# EAGLE schematic AQ_Baloo_t (EAGLE 5.11)
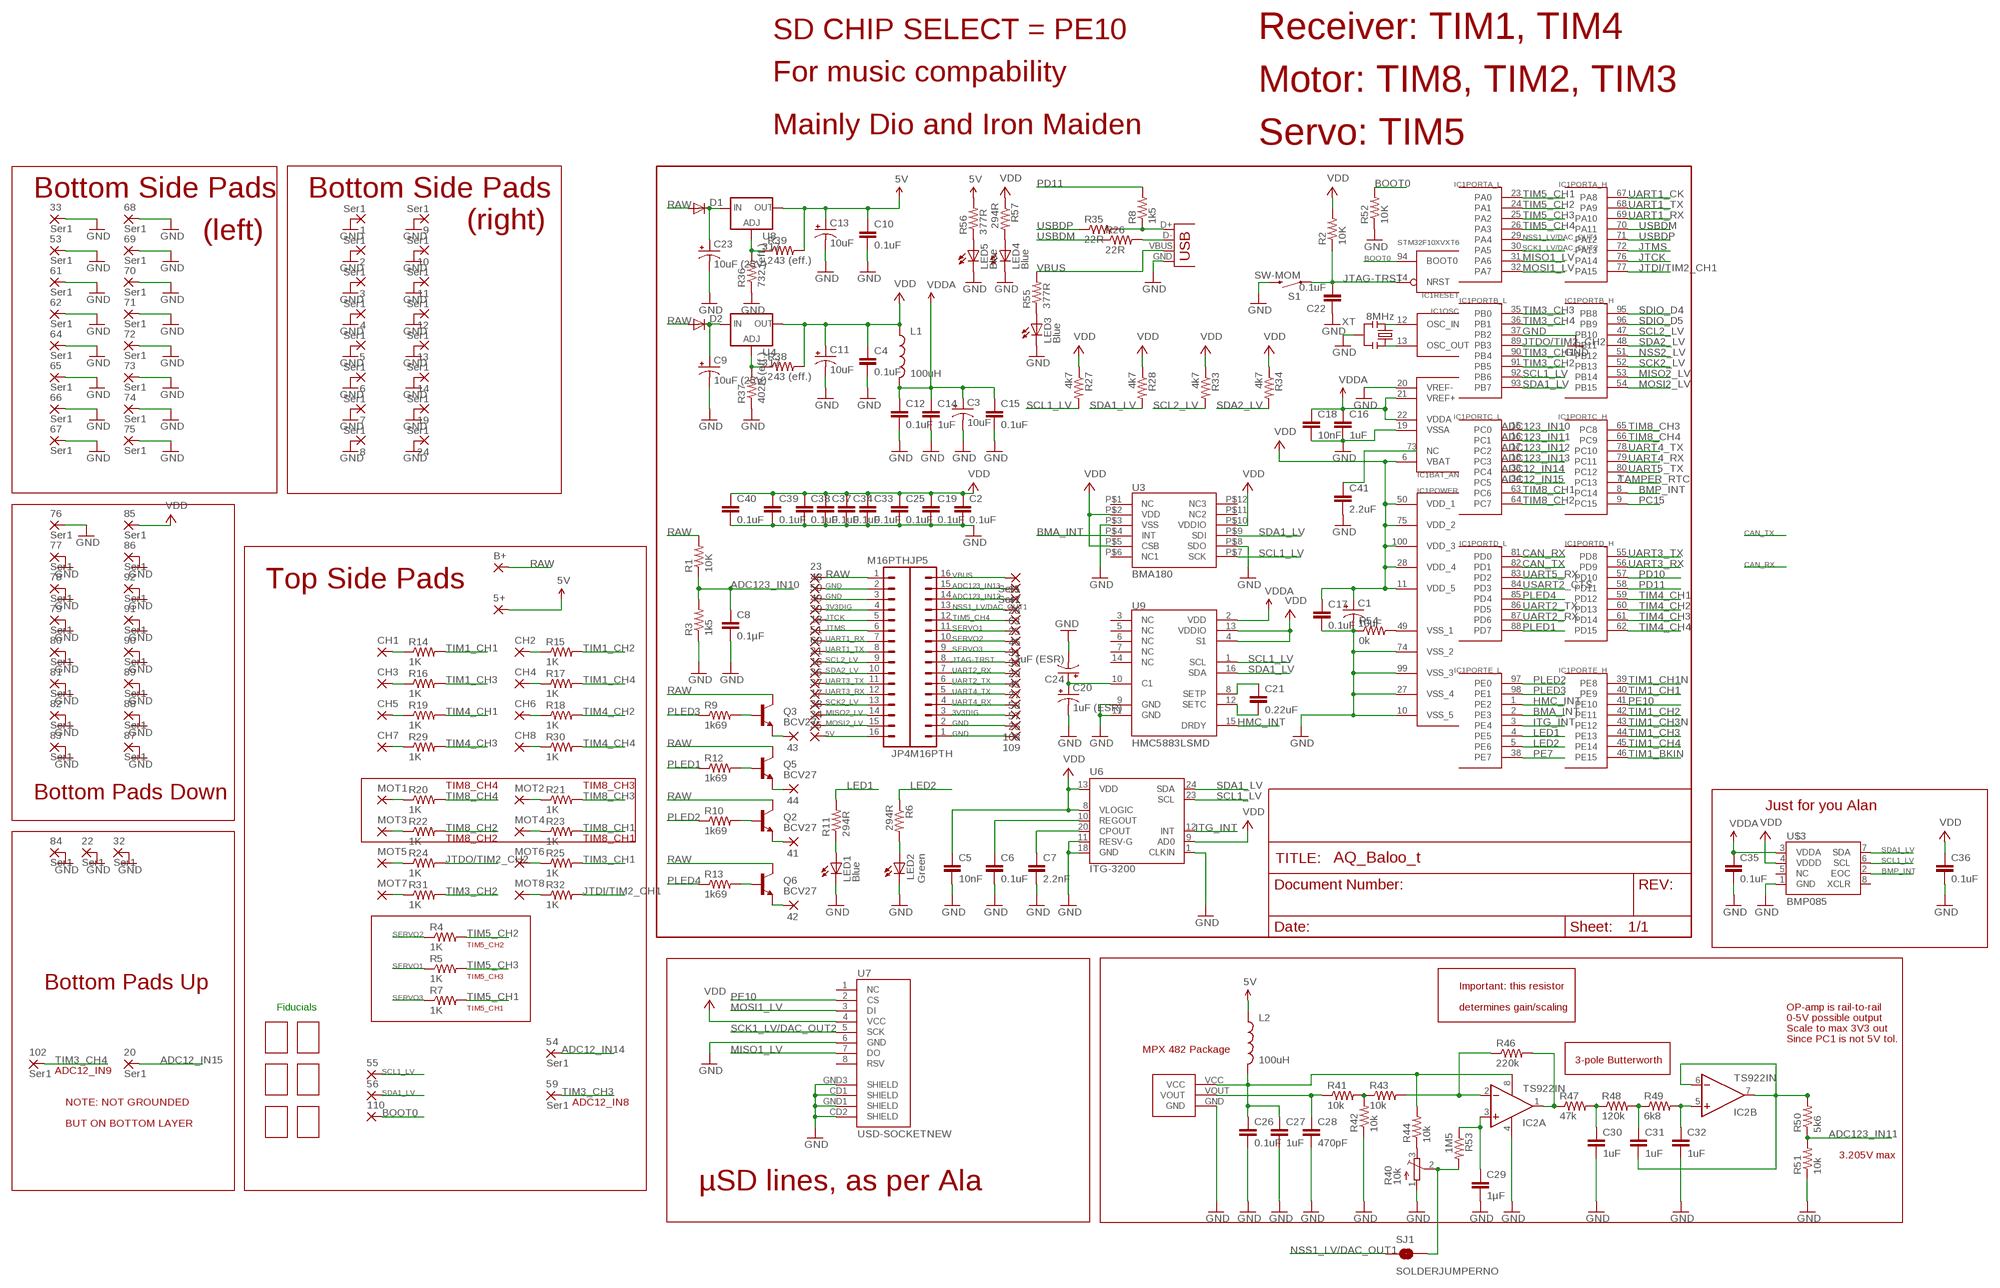
[diagram p0: schematic, sheet 1]

## Parts
1  Ser1  WIREPADSMD1,27-254  [SMD1,27-2,54]
2  Ser1  WIREPADSMD1,27-254  [SMD1,27-2,54]
3  Ser1  WIREPADSMD1,27-254  [SMD1,27-2,54]
4  Ser1  WIREPADSMD1,27-254  [SMD1,27-2,54]
5  Ser1  WIREPADSMD1,27-254  [SMD1,27-2,54]
5+  WIREPADSMD1,27-254  [SMD1,27-2,54]
6  Ser1  WIREPADSMD1,27-254  [SMD1,27-2,54]
7  Ser1  WIREPADSMD1,27-254  [SMD1,27-2,54]
8  Ser1  WIREPADSMD1,27-254  [SMD1,27-2,54]
9  Ser1  WIREPADSMD1,27-254  [SMD1,27-2,54]
10  Ser1  WIREPADSMD1,27-254  [SMD1,27-2,54]
11  Ser1  WIREPADSMD1,27-254  [SMD1,27-2,54]
12  Ser1  WIREPADSMD1,27-254  [SMD1,27-2,54]
13  Ser1  WIREPADSMD1,27-254  [SMD1,27-2,54]
14  Ser1  WIREPADSMD1,27-254  [SMD1,27-2,54]
15  WIREPADSMD1,27-254  [SMD1,27-2,54]
16  WIREPADSMD1,27-254  [SMD1,27-2,54]
17  WIREPADSMD1,27-254  [SMD1,27-2,54]
18  WIREPADSMD1,27-254  [SMD1,27-2,54]
19  Ser1  WIREPADSMD1,27-254  [SMD1,27-2,54]
20  Ser1  WIREPADSMD1,27-254  [SMD1,27-2,54]
21  WIREPADSMD1,27-254  [SMD1,27-2,54]
22  Ser1  WIREPADSMD1,27-254  [SMD1,27-2,54]
23  WIREPADSMD1,27-254  [SMD1,27-2,54]
24  Ser1  WIREPADSMD1,27-254  [SMD1,27-2,54]
25  WIREPADSMD1,27-254  [SMD1,27-2,54]
26  WIREPADSMD1,27-254  [SMD1,27-2,54]
27  WIREPADSMD1,27-254  [SMD1,27-2,54]
28  Ser1  WIREPADSMD1,27-254  [SMD1,27-2,54]
29  WIREPADSMD1,27-254  [SMD1,27-2,54]
30  WIREPADSMD1,27-254  [SMD1,27-2,54]
31  WIREPADSMD1,27-254  [SMD1,27-2,54]
32  Ser1  WIREPADSMD1,27-254  [SMD1,27-2,54]
33  Ser1  WIREPADSMD1,27-254  [SMD1,27-2,54]
34  WIREPADSMD1,27-254  [SMD1,27-2,54]
35  WIREPADSMD1,27-254  [SMD1,27-2,54]
36  WIREPADSMD1,27-254  [SMD1,27-2,54]
37  WIREPADSMD1,27-254  [SMD1,27-2,54]
38  WIREPADSMD1,27-254  [SMD1,27-2,54]
39  WIREPADSMD1,27-254  [SMD1,27-2,54]
41  WIREPADSMD1,27-254  [SMD1,27-2,54]
42  WIREPADSMD1,27-254  [SMD1,27-2,54]
43  WIREPADSMD1,27-254  [SMD1,27-2,54]
44  WIREPADSMD1,27-254  [SMD1,27-2,54]
45  WIREPADSMD1,27-254  [SMD1,27-2,54]
46  WIREPADSMD1,27-254  [SMD1,27-2,54]
47  WIREPADSMD1,27-254  [SMD1,27-2,54]
48  WIREPADSMD1,27-254  [SMD1,27-2,54]
49  WIREPADSMD1,27-254  [SMD1,27-2,54]
50  WIREPADSMD1,27-254  [SMD1,27-2,54]
51  WIREPADSMD1,27-254  [SMD1,27-2,54]
53  Ser1  WIREPADSMD1,27-254  [SMD1,27-2,54]
54  Ser1  WIREPADSMD1,27-254  [SMD1,27-2,54]
55  WIREPADSMD1,27-254  [SMD1,27-2,54]
56  WIREPADSMD1,27-254  [SMD1,27-2,54]
57  WIREPADSMD1,27-254  [SMD1,27-2,54]
58  WIREPADSMD1,27-254  [SMD1,27-2,54]
59  Ser1  WIREPADSMD1,27-254  [SMD1,27-2,54]
60  WIREPADSMD1,27-254  [SMD1,27-2,54]
61  Ser1  WIREPADSMD1,27-254  [SMD1,27-2,54]
62  Ser1  WIREPADSMD1,27-254  [SMD1,27-2,54]
63  Ser1  WIREPADSMD1,27-254  [SMD1,27-2,54]
64  Ser1  WIREPADSMD1,27-254  [SMD1,27-2,54]
65  Ser1  WIREPADSMD1,27-254  [SMD1,27-2,54]
66  Ser1  WIREPADSMD1,27-254  [SMD1,27-2,54]
67  Ser1  WIREPADSMD1,27-254  [SMD1,27-2,54]
68  Ser1  WIREPADSMD1,27-254  [SMD1,27-2,54]
69  Ser1  WIREPADSMD1,27-254  [SMD1,27-2,54]
70  Ser1  WIREPADSMD1,27-254  [SMD1,27-2,54]
71  Ser1  WIREPADSMD1,27-254  [SMD1,27-2,54]
72  Ser1  WIREPADSMD1,27-254  [SMD1,27-2,54]
73  Ser1  WIREPADSMD1,27-254  [SMD1,27-2,54]
74  Ser1  WIREPADSMD1,27-254  [SMD1,27-2,54]
75  Ser1  WIREPADSMD1,27-254  [SMD1,27-2,54]
76  Ser1  WIREPADSMD1,27-254  [SMD1,27-2,54]
77  Ser1  WIREPADSMD1,27-254  [SMD1,27-2,54]
78  Ser1  WIREPADSMD1,27-254  [SMD1,27-2,54]
79  Ser1  WIREPADSMD1,27-254  [SMD1,27-2,54]
80  Ser1  WIREPADSMD1,27-254  [SMD1,27-2,54]
81  Ser1  WIREPADSMD1,27-254  [SMD1,27-2,54]
82  Ser1  WIREPADSMD1,27-254  [SMD1,27-2,54]
83  Ser1  WIREPADSMD1,27-254  [SMD1,27-2,54]
84  Ser1  WIREPADSMD1,27-254  [SMD1,27-2,54]
85  Ser1  WIREPADSMD1,27-254  [SMD1,27-2,54]
86  Ser1  WIREPADSMD1,27-254  [SMD1,27-2,54]
87  Ser1  WIREPADSMD1,27-254  [SMD1,27-2,54]
88  Ser1  WIREPADSMD1,27-254  [SMD1,27-2,54]
89  Ser1  WIREPADSMD1,27-254  [SMD1,27-2,54]
90  Ser1  WIREPADSMD1,27-254  [SMD1,27-2,54]
91  Ser1  WIREPADSMD1,27-254  [SMD1,27-2,54]
92  Ser1  WIREPADSMD1,27-254  [SMD1,27-2,54]
102  Ser1  WIREPADSMD1,27-254  [SMD1,27-2,54]
108  WIREPADSMD1,27-254  [SMD1,27-2,54]
109  WIREPADSMD1,27-254  [SMD1,27-2,54]
110  WIREPADSMD1,27-254  [SMD1,27-2,54]
B+  WIREPADSMD1,27-254  [SMD1,27-2,54]
C1  10uF  CPOL-USSMCZ  [SMC_Z]
C2  0.1uF  CAP0402  [C0402]
C3  10uF  CAP_POL1206  [EIA3216]
C4  0.1uF  CAP0402  [C0402]
C5  10nF  CAP0402  [C0402]
C6  0.1uF  CAP0402  [C0402]
C7  2.2nF  CAP0402  [C0402]
C8  0.1µF  CAP0402  [C0402]
C9  10uF (25V)  CAP_POL1206  [EIA3216]
C10  0.1uF  CAP0402  [C0402]
C11  10uF  CAP_POL1206  [EIA3216]
C12  0.1uF  CAP0402  [C0402]
C13  10uF  CAP_POL1206  [EIA3216]
C14  1uF  CAP0402  [C0402]
C15  0.1uF  CAP0402  [C0402]
C16  1uF  CAP0402  [C0402]
C17  0.1uF  CAP0402  [C0402]
C18  10nF  CAP0402  [C0402]
C19  0.1uF  CAP0402  [C0402]
C20  1uF (ESR)  CPOL-USSMCZ  [SMC_Z]
C21  0.22uF  CAP0402  [C0402]
C22  0.1uF  CAP0402  [C0402]
C23  10uF (25V)  CAP_POL1206  [EIA3216]
C24  1uF (ESR)  CPOL-USSMCZ  [SMC_Z]
C25  0.1uF  CAP0402  [C0402]
C26  0.1uF  CAP0402  [C0402]
C27  1uF  CAP0402  [C0402]
C28  470pF  CAP0402  [C0402]
C29  1µF  CAP0402  [C0402]
C30  1uF  CAP0402  [C0402]
C31  1uF  CAP0402  [C0402]
C32  1uF  CAP0402  [C0402]
C33  0.1uF  CAP0402  [C0402]
C34  0.1uF  CAP0402  [C0402]
C35  0.1uF  CAP0402  [C0402]
C36  0.1uF  CAP0402  [C0402]
C37  0.1uF  CAP0402  [C0402]
C38  0.1uF  CAP0402  [C0402]
C39  0.1uF  CAP0402  [C0402]
C40  0.1uF  CAP0402  [C0402]
C41  2.2uF  CAP0402  [C0402]
CH1  WIREPADSMD1,27-254  [SMD1,27-2,54]
CH2  WIREPADSMD1,27-254  [SMD1,27-2,54]
CH3  WIREPADSMD1,27-254  [SMD1,27-2,54]
CH4  WIREPADSMD1,27-254  [SMD1,27-2,54]
CH5  WIREPADSMD1,27-254  [SMD1,27-2,54]
CH6  WIREPADSMD1,27-254  [SMD1,27-2,54]
CH7  WIREPADSMD1,27-254  [SMD1,27-2,54]
CH8  WIREPADSMD1,27-254  [SMD1,27-2,54]
D1  DIODESOD  [SOD-323]
D2  DIODESOD  [SOD-323]
IC1  STM32F10XVXT6  [TQFP100]
IC2  TS922IN  LM358D  [SO08]
JP4  M16PTH  [1X16]
JP5  M16PTH  [1X16]
L1  100uH  INDUCTOR0805  [0805]
L2  100uH  INDUCTOR0805  [0805]
LED1  Blue  LED0603  [LED-0603]
LED2  Green  LED0603  [LED-0603]
LED3  Blue  LED0603  [LED-0603]
LED4  Blue  LED0603  [LED-0603]
LED5  Blue  LED0603  [LED-0603]
MOT1  WIREPADSMD1,27-254  [SMD1,27-2,54]
MOT2  WIREPADSMD1,27-254  [SMD1,27-2,54]
MOT3  WIREPADSMD1,27-254  [SMD1,27-2,54]
MOT4  WIREPADSMD1,27-254  [SMD1,27-2,54]
MOT5  WIREPADSMD1,27-254  [SMD1,27-2,54]
MOT6  WIREPADSMD1,27-254  [SMD1,27-2,54]
MOT7  WIREPADSMD1,27-254  [SMD1,27-2,54]
MOT8  WIREPADSMD1,27-254  [SMD1,27-2,54]
Q2  BCV27  TRANSISTOR_NPNSOT23-3  [SOT23-3]
Q3  BCV27  TRANSISTOR_NPNSOT23-3  [SOT23-3]
Q5  BCV27  TRANSISTOR_NPNSOT23-3  [SOT23-3]
Q6  BCV27  TRANSISTOR_NPNSOT23-3  [SOT23-3]
R1  10K  RESISTOR0402  [C0402]
R2  10K  RESISTOR0402  [C0402]
R3  1k5  RESISTOR0402  [C0402]
R4  1K  RESISTOR0402  [C0402]
R5  1K  RESISTOR0402  [C0402]
R6  294R  RESISTOR0402  [C0402]
R7  1K  RESISTOR0402  [C0402]
R8  1k5  RESISTOR0402  [C0402]
R9  1k69  RESISTOR0402  [C0402]
R10  1k69  RESISTOR0402  [C0402]
R11  294R  RESISTOR0402  [C0402]
R12  1k69  RESISTOR0402  [C0402]
R13  1k69  RESISTOR0402  [C0402]
R14  1K  RESISTOR0402  [C0402]
R15  1K  RESISTOR0402  [C0402]
R16  1K  RESISTOR0402  [C0402]
R17  1K  RESISTOR0402  [C0402]
R18  1K  RESISTOR0402  [C0402]
R19  1K  RESISTOR0402  [C0402]
R20  1K  RESISTOR0402  [C0402]
R21  1K  RESISTOR0402  [C0402]
R22  1K  RESISTOR0402  [C0402]
R23  1K  RESISTOR0402  [C0402]
R24  1K  RESISTOR0402  [C0402]
R25  1K  RESISTOR0402  [C0402]
R26  22R  RESISTOR0402  [C0402]
R27  4k7  RESISTOR0402  [C0402]
R28  4k7  RESISTOR0402  [C0402]
R29  1K  RESISTOR0402  [C0402]
R30  1K  RESISTOR0402  [C0402]
R31  1K  RESISTOR0402  [C0402]
R32  1K  RESISTOR0402  [C0402]
R33  4k7  RESISTOR0402  [C0402]
R34  4k7  RESISTOR0402  [C0402]
R35  22R  RESISTOR0402  [C0402]
R36  732 (eff.)  RESISTOR0603  [0603]
R37  402R (eff.)  RESISTOR0603  [0603]
R38  243 (eff.)  RESISTOR0603  [0603]
R39  243 (eff.)  RESISTOR0603  [0603]
R40  10k  TRIM_EU-3223J  [3223J]
R41  10k  RESISTOR0402  [C0402]
R42  10k  RESISTOR0402  [C0402]
R43  10k  RESISTOR0402  [C0402]
R44  10k  RESISTOR0402  [C0402]
R46  220k  RESISTOR0402  [C0402]
R47  47k  RESISTOR0402  [C0402]
R48  120k  RESISTOR0402  [C0402]
R49  6k8  RESISTOR0402  [C0402]
R50  5k6  RESISTOR0402  [C0402]
R51  10k  RESISTOR0402  [C0402]
R52  10K  RESISTOR0402  [C0402]
R53  1M5  RESISTOR0402  [C0402]
R54  0k  RESISTOR0402  [C0402]
R55  377R  RESISTOR0402  [C0402]
R56  377R  RESISTOR0402  [C0402]
R57  294R  RESISTOR0402  [C0402]
S1  SW-MOM  SWITCH-MOMENTARY-2SMD  [TACTILE_SWITCH_SMD]
SJ1  SOLDERJUMPERNO  [SJ_2S-NO]
U3  BMA180  [LGA12]
U4  317  V_REG_317SMD  [SOT223]
U6  ITG-3200  [QFN-24]
U7  USD-SOCKETNEW  [MICRO-SD-SOCKET-PP]
U8  317  V_REG_317SMD  [SOT223]
U9  HMC5883LSMD  [16LPCC]
U$2  MPX_SMD  [MPX_SMD]
U$3  BMP085  [BMP085]
U$7  PAD.03  [PAD.03X.03]
U$9  PAD.03  [PAD.03X.03]
U$10  PAD.03  [PAD.03X.03]
U$11  PAD.03  [PAD.03X.03]
U$12  PAD.03  [PAD.03X.03]
U$13  PAD.03  [PAD.03X.03]
X2  USBOLD  [USB-MINIB-OLD]
XT  8MHz  RESONATORSMD  [RESONATOR-SMD]

## Nets
3IN [vcc]: C9.A(+) D2.1(C) U4.3(IN)
3V3AN: C3.A(+) C12.1 C14.1 C15.1 C16.1 C18.1 C35.1 IC1.21(BAT_AN:VREF+) IC1.22(BAT_AN:VDDA) L1.2 U9.2(VDD) U$3.3(VDDA) ; supply symbol labelled VDDA
3V3DIG: 26.1(P) 49.1(P) 85.1(P) C1.+ C2.1 C4.1 C5.1 C11.A(+) C17.1 C19.1 C25.1 C33.1 C34.1 C36.1 C37.1 C38.1 C39.1 C40.1 IC1.6(BAT_AN:VBAT) IC1.11(POWER:VDD_5) IC1.28(POWER:VDD_4) IC1.50(POWER:VDD_1) IC1.75(POWER:VDD_2) IC1.100(POWER:VDD_3) JP4.4 JP5.3 L1.1 R2.2 R27.1 R28.1 R33.1 R34.1 R38.2 R57.1 U3.P$2(VDD) U3.P$5(CSB) U3.P$10(VDDIO) U4.2(OUT) U6.8(VLOGIC) U6.9(AD0) U6.13(VDD) U7.4(VCC) U9.4(S1) U9.13(VDDIO) U$3.4(VDDD) ; supply symbol labelled VDD
5IN [vcc]: C23.A(+) D1.1(C) U8.3(IN)
5V: 5+.1(P) 35.1(P) C10.1 C13.A(+) JP4.16 L2.1 R39.2 R56.2 U8.2(OUT)
ADC12_IN14: 54.1(P) IC1.33(PORTC_L:PC4)
ADC12_IN15: 20.1(P) IC1.34(PORTC_L:PC5)
ADC123_IN10: C8.1 IC1.15(PORTC_L:PC0) R1.1 R3.2
ADC123_IN11: IC1.16(PORTC_L:PC1) R50.1 R51.2
ADC123_IN12: 28.1(P) IC1.17(PORTC_L:PC2) JP5.14
ADC123_IN13: 47.1(P) IC1.18(PORTC_L:PC3) JP5.15
BMA_INT: IC1.2(PORTE_L:PE3) U3.P$4(INT)
BMP_INT: IC1.8(PORTC_H:PC14) U$3.2(EOC)
BOOT0: 110.1(P) IC1.94(RESET:BOOT0) R52.2
CAN_RX: IC1.81(PORTD_L:PD0)
CAN_TX: IC1.82(PORTD_L:PD1)
GND [vcc]: 1.1(P) 2.1(P) 3.1(P) 4.1(P) 5.1(P) 6.1(P) 7.1(P) 8.1(P) 9.1(P) 10.1(P) 11.1(P) 12.1(P) 13.1(P) 14.1(P) 19.1(P) 22.1(P) 24.1(P) 32.1(P) 33.1(P) 48.1(P) 50.1(P) 53.1(P) 61.1(P) 62.1(P) 64.1(P) 65.1(P) 66.1(P) 67.1(P) 68.1(P) 69.1(P) 70.1(P) 71.1(P) 72.1(P) 73.1(P) 74.1(P) 75.1(P) 76.1(P) 77.1(P) 78.1(P) 79.1(P) 80.1(P) 81.1(P) 82.1(P) 83.1(P) 84.1(P) 86.1(P) 87.1(P) 88.1(P) 89.1(P) 90.1(P) 91.1(P) 92.1(P) 108.1(P) 109.1(P) C1.- C2.2 C3.C(-) C4.2 C5.2 C6.2 C7.2 C8.2 C9.C(-) C10.2 C11.C(-) C12.2 C13.C(-) C14.2 C15.2 C16.2 C17.2 C18.2 C19.2 C20.- C22.1 C23.C(-) C24.- C25.2 C26.2 C27.2 C28.2 C29.2 C30.2 C32.2 C33.2 C34.2 C35.2 C36.2 C37.2 C38.2 C39.2 C40.2 C41.2 IC1.10(POWER:VSS_5) IC1.19(BAT_AN:VSSA) IC1.20(BAT_AN:VREF-) IC1.27(POWER:VSS_4) IC1.37(PORTB_L:PB2) IC1.74(POWER:VSS_2) IC1.99(POWER:VSS_3) IC2.4(P:V-) JP4.2 JP4.3 JP5.1 JP5.2 LED1.C LED2.C LED3.C LED4.C LED5.C R3.1 R36.1 R37.1 R40.1(A) R42.1 R51.1 R52.1 R54.1 S1.3 U3.P$3(VSS) U3.P$8(SDO) U6.1(CLKIN) U6.11(RESV-G) U6.18(GND) U7.6(GND) U7.CD1(SHIELD) U7.CD2(SHIELD) U7.GND1(SHIELD) U7.GND3(SHIELD) U9.9(GND) U9.11(GND) U$2.GND U$3.1(GND) X2.GND XT.2
HMC_INT: IC1.1(PORTE_L:PE2) U9.15(DRDY)
ITG_INT: IC1.3(PORTE_L:PE4) U6.12(INT)
JTAG-TRST: 29.1(P) C22.2 IC1.14(RESET:NRST) JP5.8 R2.1 S1.1
JTCK: 39.1(P) IC1.76(PORTA_H:PA14) JP4.5
JTDI/TIM2_CH1: IC1.77(PORTA_H:PA15) R32.2
JTDO/TIM2_CH2: IC1.89(PORTB_L:PB3) R24.2
JTMS: 18.1(P) IC1.72(PORTA_H:PA13) JP4.6
LED1: IC1.4(PORTE_L:PE5) R11.2
LED2: IC1.5(PORTE_L:PE6) R6.1
MISO1_LV: IC1.31(PORTA_L:PA6) U7.7(DO)
MISO2_LV: 38.1(P) IC1.53(PORTB_H:PB14) JP4.14
MOSI1_LV: IC1.32(PORTA_L:PA7) U7.3(DI)
MOSI2_LV: 34.1(P) IC1.54(PORTB_H:PB15) JP4.15
N$1: IC1.12(OSC:OSC_IN) XT.3
N$2: IC1.13(OSC:OSC_OUT) XT.1
N$3: CH4.1(P) R17.1
N$4: MOT1.1(P) R20.1
N$5: R40.2(S) R53.2 SJ1.2
N$6: C6.1 U6.10(REGOUT)
N$7: LED2.A R6.2
N$8: C7.1 U6.20(CPOUT)
N$9: Q3.1(B) R9.2
N$10: IC1.49(POWER:VSS_1) R54.2
N$11: Q2.1(B) R10.2
N$12: Q5.1(B) R12.2
N$13: MOT2.1(P) R21.1
N$14: MOT3.1(P) R22.1
N$15: LED1.A R11.1
N$16: R36.2 R39.1 U8.1(ADJ)
N$17: CH1.1(P) R14.1
N$18: CH2.1(P) R15.1
N$19: CH3.1(P) R16.1
N$20: MOT4.1(P) R23.1
N$21: CH5.1(P) R19.1
N$22: CH6.1(P) R18.1
N$23: Q6.1(B) R13.2
N$24: 41.1(P) Q2.2(E)
N$25: 42.1(P) Q6.2(E)
N$26: 43.1(P) Q3.2(E)
N$27: 44.1(P) Q5.2(E)
N$28: C41.1 IC1.73(BAT_AN:NC)
N$29: LED3.A R55.1
N$30: CH7.1(P) R29.1
N$31: MOT5.1(P) R24.1
N$32: MOT6.1(P) R25.1
N$33: R37.2 R38.1 U4.1(ADJ)
N$34: LED4.A R57.2
N$35: LED5.A R56.1
N$37: CH8.1(P) R30.1
N$38: MOT7.1(P) R31.1
N$39: MOT8.1(P) R32.1
N$41: C21.1 U9.8(SETP)
N$42: C21.2 U9.12(SETC)
N$43: C26.1 C27.1 IC2.8(P:V+) L2.2 R44.2 U$2.VCC
N$67: C20.+ C24.+ U9.10(C1)
N$72: R8.1 R35.2 X2.D+
N$74: R26.2 X2.D-
N$76: C28.1 R41.1 U$2.VOUT
N$77: R41.2 R42.2 R43.1
N$79: IC2.2(A:-IN) R43.2 R46.1
N$80: C29.1 IC2.3(A:+IN) R53.1
N$81: R40.3(E) R44.1
N$82: IC2.1(A:OUT) R46.2 R47.1
N$98: C30.1 R47.2 R48.1
N$99: C31.1 R48.2 R49.1
N$100: C32.1 IC2.5(B:+IN) R49.2
N$101: C31.2 IC2.6(B:-IN) IC2.7(B:OUT) R50.2
NSS1_LV/DAC_OUT1: 63.1(P) IC1.29(PORTA_L:PA4) JP5.13 SJ1.1
NSS2_LV: IC1.51(PORTB_H:PB12)
PC15: IC1.9(PORTC_H:PC15)
PD10: IC1.57(PORTD_H:PD10)
PD11: IC1.58(PORTD_H:PD11) R8.2
PE7: IC1.38(PORTE_L:PE7)
PE10: IC1.41(PORTE_H:PE10) U7.2(CS)
PLED1: IC1.88(PORTD_L:PD7) R12.1
PLED2: IC1.97(PORTE_L:PE0) R10.1
PLED3: IC1.98(PORTE_L:PE1) R9.1
PLED4: IC1.85(PORTD_L:PD4) R13.1
RAW [vcc]: 23.1(P) B+.1(P) D1.2(A) D2.2(A) JP4.1 Q2.3(C) Q3.3(C) Q5.3(C) Q6.3(C) R1.2
SCK1_LV/DAC_OUT2: IC1.30(PORTA_L:PA5) U7.5(SCK)
SCK2_LV: 17.1(P) IC1.52(PORTB_H:PB13) JP4.13
SCL1_LV: 55.1(P) IC1.92(PORTB_L:PB6) R27.2 U3.P$7(SCK) U6.23(SCL) U9.1(SCL) U$3.6(SCL)
SCL2_LV: 21.1(P) IC1.47(PORTB_H:PB10) JP4.9 R33.2
SDA1_LV: 56.1(P) IC1.93(PORTB_L:PB7) R28.2 U3.P$9(SDI) U6.24(SDA) U9.16(SDA) U$3.7(SDA)
SDA2_LV: 16.1(P) IC1.48(PORTB_H:PB11) JP4.10 R34.2
SDIO_D4: IC1.95(PORTB_H:PB8)
SDIO_D5: IC1.96(PORTB_H:PB9)
SERVO1: 46.1(P) JP5.11 R5.1
SERVO2: 31.1(P) JP5.10 R4.1
SERVO3: 30.1(P) JP5.9 R7.1
TAMPER_RTC: IC1.7(PORTC_H:PC13)
TIM1_BKIN: IC1.46(PORTE_H:PE15)
TIM1_CH1: IC1.40(PORTE_H:PE9) R14.2
TIM1_CH1N: IC1.39(PORTE_H:PE8)
TIM1_CH2: IC1.42(PORTE_H:PE11) R15.2
TIM1_CH3: IC1.44(PORTE_H:PE13) R16.2
TIM1_CH3N: IC1.43(PORTE_H:PE12)
TIM1_CH4: IC1.45(PORTE_H:PE14) R17.2
TIM3_CH1: IC1.90(PORTB_L:PB4) R25.2
TIM3_CH2: IC1.91(PORTB_L:PB5) R31.2
TIM3_CH3: 59.1(P) IC1.35(PORTB_L:PB0)
TIM3_CH4: 102.1(P) IC1.36(PORTB_L:PB1)
TIM4_CH1: IC1.59(PORTD_H:PD12) R19.2
TIM4_CH2: IC1.60(PORTD_H:PD13) R18.2
TIM4_CH3: IC1.61(PORTD_H:PD14) R29.2
TIM4_CH4: IC1.62(PORTD_H:PD15) R30.2
TIM5_CH1: IC1.23(PORTA_L:PA0) R7.2
TIM5_CH2: IC1.24(PORTA_L:PA1) R4.2
TIM5_CH3: IC1.25(PORTA_L:PA2) R5.2
TIM5_CH4: 25.1(P) IC1.26(PORTA_L:PA3) JP5.12
TIM8_CH1: IC1.63(PORTC_L:PC6) R23.2
TIM8_CH2: IC1.64(PORTC_L:PC7) R22.2
TIM8_CH3: IC1.65(PORTC_H:PC8) R21.2
TIM8_CH4: IC1.66(PORTC_H:PC9) R20.2
UART1_CK: IC1.67(PORTA_H:PA8)
UART1_RX: 51.1(P) IC1.69(PORTA_H:PA10) JP4.7
UART1_TX: 60.1(P) IC1.68(PORTA_H:PA9) JP4.8
UART2_RX: 45.1(P) IC1.87(PORTD_L:PD6) JP5.7
UART2_TX: 27.1(P) IC1.86(PORTD_L:PD5) JP5.6
UART3_RX: 37.1(P) IC1.56(PORTD_H:PD9) JP4.12
UART3_TX: 36.1(P) IC1.55(PORTD_H:PD8) JP4.11
UART4_RX: 57.1(P) IC1.79(PORTC_H:PC11) JP5.4
UART4_TX: 58.1(P) IC1.78(PORTC_H:PC10) JP5.5
UART5_RX: IC1.83(PORTD_L:PD2)
UART5_TX: IC1.80(PORTC_H:PC12)
USART2_CTS: IC1.84(PORTD_L:PD3)
USBDM: IC1.70(PORTA_H:PA11) R26.1
USBDP: IC1.71(PORTA_H:PA12) R35.1
VBUS: 15.1(P) JP5.16 R55.2 X2.VBUS
Unconnected: U3.P$1(NC) U3.P$6(NC1) U3.P$11(NC2) U3.P$12(NC3) U7.1(NC) U7.8(RSV) U9.3(NC) U9.5(NC) U9.6(NC) U9.7(NC) U9.14(NC) U$3.5(NC) U$3.8(XCLR)

## Notes on the sheet
- SD CHIP SELECT = PE10 | Receiver: TIM1, TIM4
- For music compability
- Motor: TIM8, TIM2, TIM3
- Mainly Dio and Iron Maiden
- Servo: TIM5
- Bottom Side Pads | Bottom Side Pads
- (right)
- (left)
- Top Side Pads
- TIM8_CH4 | TIM8_CH3
- Bottom Pads Down
- Just for you Alan
- TIM8_CH2 | TIM8_CH1
- TIM5_CH2
- TIM5_CH3
- Bottom Pads Up | Important: this resistor
- Fiducials | TIM5_CH1 | determines gain/scaling | OP-amp is rail-to-rail
- 0-5V possible output
- Scale to max 3V3 out
- Since PC1 is not 5V tol.
- MPX 482 Package
- 3-pole Butterworth
- ADC12_IN9
- NOTE: NOT GROUNDED | ADC12_IN8
- BUT ON BOTTOM LAYER
- 3.205V max
- µSD lines, as per Ala

## Library data of the parts
1-5 5+ 6-39 41-51 53-92 102 108-110 B+ CH1-CH8 MOT1-MOT8 = wirepad:WIREPAD: Wire PAD connect wire on PCB
C1 C20 C24 = rcl:CPOL-US: POLARIZED CAPACITOR, American symbol
C2 C4-C8 C10 C12 C14-C19 C21 C22 C25-C41 = SparkFun:CAP: Capacitor Standard 0603 ceramic capacitor, and 0.1" leaded capacitor.
C3 C9 C11 C13 C23 = SparkFun:CAP_POL: Capacitor Polarized These are standard SMD and PTH capacitors. Normally 10uF, 47uF, and 100uF in electrolytic and tantalum varieties. Always verify the external diameter of the through hole cap, it varies with capacity, voltage, and manufacturer. The EIA devices should be standard.
D1 D2 = SparkFun:DIODE: Diode These are standard reverse protection diodes and small signal diodes. SMA package can handle up to about 1A. SOD-323 can handle about 200mA. What the SOD-323 package when ordering, there are some mfgs out there that are 5-pin packages.
IC1 = stm32:STM32F10XVXT6: STM32F101/103 100 pin LQFP
IC2 = linear:LM358: OP AMP also LM158; LM258; LM2904 Source: http://cache.national.com/ds/LM/LM158.pdf
JP4 JP5 = SparkFun:M16
L1 L2 = SparkFun:INDUCTOR: Inductors Basic Inductor/Choke - 0603 and 1206. Footprints are not proven and vary greatly between part numbers.
LED1-LED5 = SparkFun:LED: LEDs Standard schematic elements and footprints for 5mm, 3mm, 1206, and 0603 sized LEDs. 5mm - Spark Fun Electronics SKU : COM-00529 (and others)
Q2 Q3 Q5 Q6 = SparkFun:TRANSISTOR_NPN: Transistor NPN BJT configuration in SOT23 package. MMBT2222 is the common NPN we use. Double check BCE configuration again layout.
R1-R39 R41-R44 R46-R57 = SparkFun:RESISTOR: Resistor Basic schematic elements and footprints for 0603, 1206, and PTH 1/10th watt (small) resistors.
R40 = pot:TRIM_EU-: POTENTIOMETER
S1 = SparkFun:SWITCH-MOMENTARY-2
SJ1 = SparkFun:SOLDERJUMPER: Solder Jumper Standard SMD solder jumper. Used to automate production. Two varients : Normally Open and Normally Closed are the same, but have different paste layers. NC will have a large amount of paste and should jumper during reflow.
U3 = SparkFun:BMA180
U4 U8 = SparkFun:V_REG_317: Voltage Regulator Standard LM317 adjustable voltage regulator. AOI (Adjust Output Input). Google 'LM317 Calculator' for easy to use app to get the two resistor values needed. 240/720 for 5V output. 240/390 for 3.3V output. Spark Fun Electronics SKU : COM-00527
U6 = SparkFun:ITG-3200: ITG-3200 3-axis gyro, digital output, qfn24 package
U7 = SparkFun:USD-SOCKET: microSD Socket Push-push type uSD socket. Schematic element and footprint production proven. Spark Fun Electronics SKU : PRT-00127. tDoc lines correctly indicate media card edge positions when inserting (unlocked, locked, depressed).
U9 = SparkFun:HMC5883L: 3 Axis Digital Compass IC
U$2 = MPX_SMD:MPX_SMD
U$3 = SparkFun:BMP085: BMP085 Pressure Sensor Great little MEMS pressure sensor. SKU: COM-09603
U$7 U$9-U$13 = SparkFun:PAD
X2 = SparkFun:USB: USB Connectors USB-B-PTH is fully proven SKU : PRT-00139 USB-miniB is fully proven SKU : PRT-00587 USB-A-PCB is untested. USB-A-H is throughly reviewed, but untested. Spark Fun Electronics SKU : PRT-00437 USB-B-SMT is throughly reviewed, but untested. Needs silkscreen touching up. USB-A-S has not been used/tested USB-MB-H has not been used/tested
XT = SparkFun:RESONATOR: Resonator Small SMD resonator. This is the itty bitty 10/20MHz resonators with built in caps. CSTCE10M0G55 and CSTCE20M0V53. Footprint has been reviewed closely but hasn't been tested yet.

## Net classes
0 default: width 0.203 mm
1 vcc: width 0.254 mm